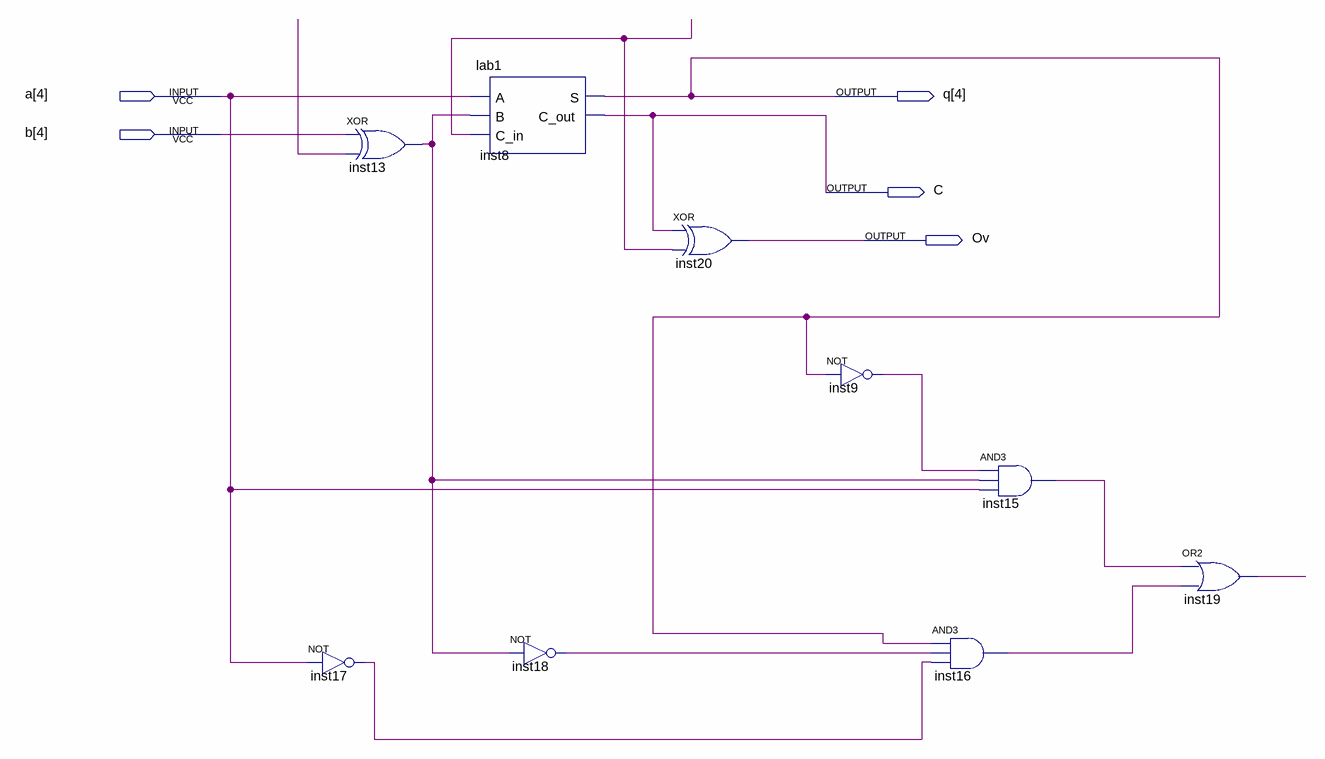
[diagram p0: schematic sheet]
// Quartus schematic dop.bdf as structural Verilog: 9 symbols, 5 pins
module dop (
  input  [4:4] a,
  input  [4:4] b,
  output [4:4] q,
  output C,
  output Ov
);

  wire inst9_out, inst13_out, inst15_out, inst16_out, inst17_out, inst18_out, inst19_out, undriven,
       undriven_2;

  not inst17 (inst17_out, a[4]);
  xor inst13 (inst13_out, b[4], undriven);
  lab1 inst8 (.A(a[4]), .B(inst13_out), .C_in(undriven_2), .S(q[4]), .C_out(C));
  not inst18 (inst18_out, inst13_out);
  xor inst20 (Ov, C, undriven_2);
  not inst9 (inst9_out, q[4]);
  and inst16 (inst16_out, q[4], inst18_out, inst17_out);
  and inst15 (inst15_out, inst9_out, inst13_out, a[4]);
  or inst19 (inst19_out, inst15_out, inst16_out);
endmodule
